# Altium schematic sheet STM32F101.SchDoc
size A4; SheetNumber: 1; SheetTotal: 1
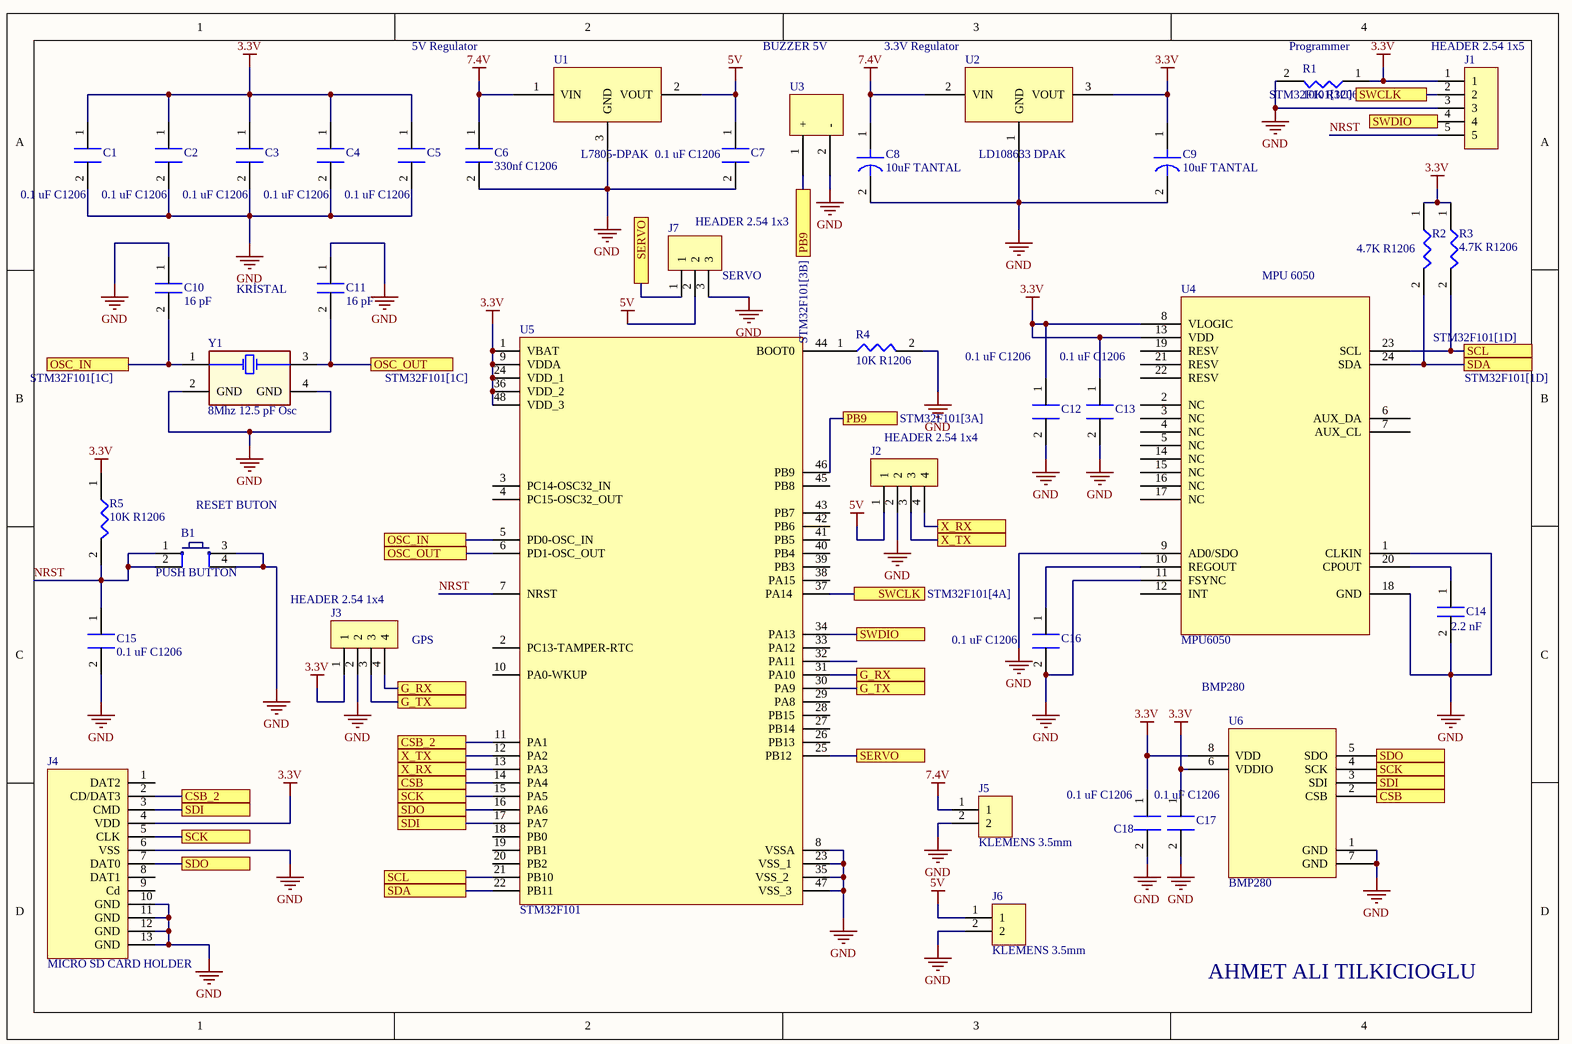
[diagram p0: STM32F101.SchDoc]

## Parts
B1  PUSH BUTTON  [PUSH BUTTON]
C1  0.1 uF C1206  [C1206]
C2  0.1 uF C1206  [C1206]
C3  0.1 uF C1206  [C1206]
C4  0.1 uF C1206  [C1206]
C5  0.1 uF C1206  [C1206]
C6  330nf C1206  [C1206]
C7  0.1 uF C1206  [C1206]
C8  10uF TANTAL  [C1206 TANTAL]
C9  10uF TANTAL  [C1206 TANTAL]
C10  16 pF  [C1206]
C11  16 pF  [C1206]
C12  0.1 uF C1206  [C1206]
C13  0.1 uF C1206  [C1206]
C14  2.2 nF  [C1206]
C15  0.1 uF C1206  [C1206]
C16  0.1 uF C1206  [C1206]
C17  0.1 uF C1206  [C1206]
C18  0.1 uF C1206  [C1206]
J1  HEADER 2.54 1x5  [HEADER 2.54 1x5]
J2  HEADER 2.54 1x4  [HEADER 2.54 1x4]
J3  HEADER 2.54 1x4  [HEADER 2.54 1x4]
J4  MICRO SD CARD HOLDER  [MICRO SD CARD HOLDER]
J5  KLEMENS 3.5mm  [KLEMENS 3.5mm]
J6  KLEMENS 3.5mm  [KLEMENS 3.5mm]
J7  HEADER 2.54 1x3  [HEADER 2.54 1x3]
R1  10K R1206  [1206 RESISTOR]
R2  4.7K R1206  [1206 RESISTOR]
R3  4.7K R1206  [1206 RESISTOR]
R4  10K R1206  [1206 RESISTOR]
R5  10K R1206  [1206 RESISTOR]
U1  L7805-DPAK  [DPAK228P972X230-3N]
U2  LD108633 DPAK  [DPAK228P972X230-3N]
U3  BUZZER 5V  [BUZZER 5V]
U4  MPU6050  [QFN50P400X400X90_HS-25N]
U5  STM32F101  [LFQP48-STM32]
U6  BMP280  [BMP280]
Y1  8Mhz 12.5 pF Osc  [8 Mhz Osc]

## Ports
CSB (see STM32F101[2D]), CSB (see STM32F101[4D]), CSB_2 (see STM32F101[1D]), CSB_2 (see STM32F101[2C]), G_RX (see STM32F101[2C]), G_RX (see STM32F101[3C]), G_TX (see STM32F101[2C]), G_TX (see STM32F101[3C]), OSC_IN (see STM32F101[1B]), OSC_IN (see STM32F101[1C]), OSC_OUT (see STM32F101[1B]), OSC_OUT (see STM32F101[1C]), PB9 (see STM32F101[3A]), PB9 (see STM32F101[3B]), SCK (see STM32F101[1D], STM32F101[2D]), SCK (see STM32F101[1D], STM32F101[4C]), SCK (see STM32F101[2D], STM32F101[4C]), SCL (see STM32F101[1D]), SCL (see STM32F101[4B]), SDA (see STM32F101[1D]), SDA (see STM32F101[4B]), SDI (see STM32F101[1D], STM32F101[2D]), SDI (see STM32F101[1D], STM32F101[4D]), SDI (see STM32F101[2D], STM32F101[4D]), SDO (see STM32F101[1D], STM32F101[2D]), SDO (see STM32F101[1D], STM32F101[4C]), SDO (see STM32F101[2D], STM32F101[4C]), SERVO (see STM32F101[2B]), SERVO (see STM32F101[3C]), SWCLK (see STM32F101[3C]), SWCLK (see STM32F101[4A]), SWDIO (see STM32F101[3C]), SWDIO (see STM32F101[4A]), X_RX (see STM32F101[2C]), X_RX (see STM32F101[3C]), X_TX (see STM32F101[2C]), X_TX (see STM32F101[3C])

## Nets
3.3V: C1.1 C2.1 C3.1 C4.1 C5.1 C9.1 C12.1 C13.1 C17.1 C18.1 J1.1 J3.1 J4.4(VDD) R1.1 R2.1 R3.1 R5.1 U2.3(VOUT) U4.8(VLOGIC) U4.13(VDD) U5.1(VBAT) U5.9(VDDA) U5.24(VDD_1) U5.36(VDD_2) U5.48(VDD_3) U6.6(VDDIO) U6.8(VDD)
5V: C7.1 J2.1 J6.1 J7.2 U1.2(VOUT)
7.4V: C6.1 C8.1 J5.1 U1.1(VIN) U2.2(VIN)
GND: B1.3 B1.4 C1.2 C2.2 C3.2 C4.2 C5.2 C6.2 C7.2 C8.2 C9.2 C10.1 C11.1 C12.2 C13.2 C14.2 C15.2 C16.2 C17.2 C18.2 J1.3 J2.2 J3.2 J4.6(VSS) J4.10(GND) J4.11(GND) J4.12(GND) J4.13(GND) J5.2 J6.2 J7.3 R1.2 R4.2 U1.3(GND) U2.1(GND) U3.2(-) U4.1(CLKIN) U4.9(AD0/SDO) U4.11(FSYNC) U4.18(GND) U5.8(VSSA) U5.23(VSS_1) U5.35(VSS_2) U5.47(VSS_3) U6.1(GND) U6.7(GND) Y1.2(GND) Y1.4(GND)
CSB: U5.14(PA4) U6.2(CSB) ; port CSB
CSB_2: J4.2(CD/DAT3) U5.11(PA1) ; port CSB_2
G_RX: J3.4 U5.31(PA10) ; port G_RX
G_TX: J3.3 U5.30(PA9) ; port G_TX
NRST: B1.1 B1.2 C15.1 J1.5 R5.2 U5.7(NRST)
OSC_IN: C10.2 U5.5(PD0-OSC_IN) Y1.1 ; port OSC_IN
OSC_OUT: C11.2 U5.6(PD1-OSC_OUT) Y1.3 ; port OSC_OUT
PB9: U3.1(+) U5.46(PB9) ; port PB9
SCK: J4.5(CLK) U5.15(PA5) U6.4(SCK) ; port SCK
SCL: R3.2 U4.23(SCL) U5.21(PB10) ; port SCL
SDA: R2.2 U4.24(SDA) U5.22(PB11) ; port SDA
SDI: J4.3(CMD) U5.17(PA7) U6.3(SDI) ; port SDI
SDO: J4.7(DAT0) U5.16(PA6) U6.5(SDO) ; port SDO
SERVO: J7.1 U5.25(PB12) ; port SERVO
SWCLK: J1.2 U5.37(PA14) ; port SWCLK
SWDIO: J1.4 U5.34(PA13) ; port SWDIO
X_RX: J2.4 U5.13(PA3) ; port X_RX
X_TX: J2.3 U5.12(PA2) ; port X_TX
NetC14_1: C14.1 U4.20(CPOUT)
NetC16_1: C16.1 U4.10(REGOUT)
NetR4_1: R4.1 U5.44(BOOT0)

Not connected (* = marked no-connect by the designer): J4 1(DAT2) 8(DAT1) 9(Cd); U4 2(NC) 3(NC) 4(NC) 5(NC) 6(AUX_DA) 7(AUX_CL) 12(INT) 14(NC) 15(NC) 16(NC) 17(NC) 19(RESV) 21(RESV) 22(RESV); U5 2(PC13-TAMPER-RTC) 3(PC14-OSC32_IN) 4(PC15-OSC32_OUT) 10(PA0-WKUP) 18(PB0) 19(PB1) 20(PB2) 26(PB13) 27(PB14) 28(PB15) 29(PA8) 32(PA11) 33(PA12) 38(PA15) 39(PB3) 40(PB4) 41(PB5) 42(PB6) 43(PB7) 45(PB8)

## Notes on the sheet
- 5V Regulator
- (near U2) 3.3V Regulator
- (near R1) Programmer
- KRİSTAL
- (near J7) SERVO
- (near U4) MPU 6050
- (near B1) RESET BUTON
- (near J3) GPS
- BMP280
- AHMET ALI TILKICIOGLU

## Library data of the parts
C1-C5 C7 C12 C13 C15-C18 = 0.1 uF C1206: 0.1 uF
C6 = 330nf C1206: 330 nF
U1 = L7805-DPAK: L7805 5V REGULATOR
U2 = LD108633 DPAK: LD108633 3.3V REGULATOR
U4 = MPU6050: MPU6050 GYRO
U5 = STM32F101: STM32F101 48 pinli Mikroişlemci
U6 = BMP280: Pressure Sensor